# Altium schematic sheet Sheet1.SchDoc
size A2
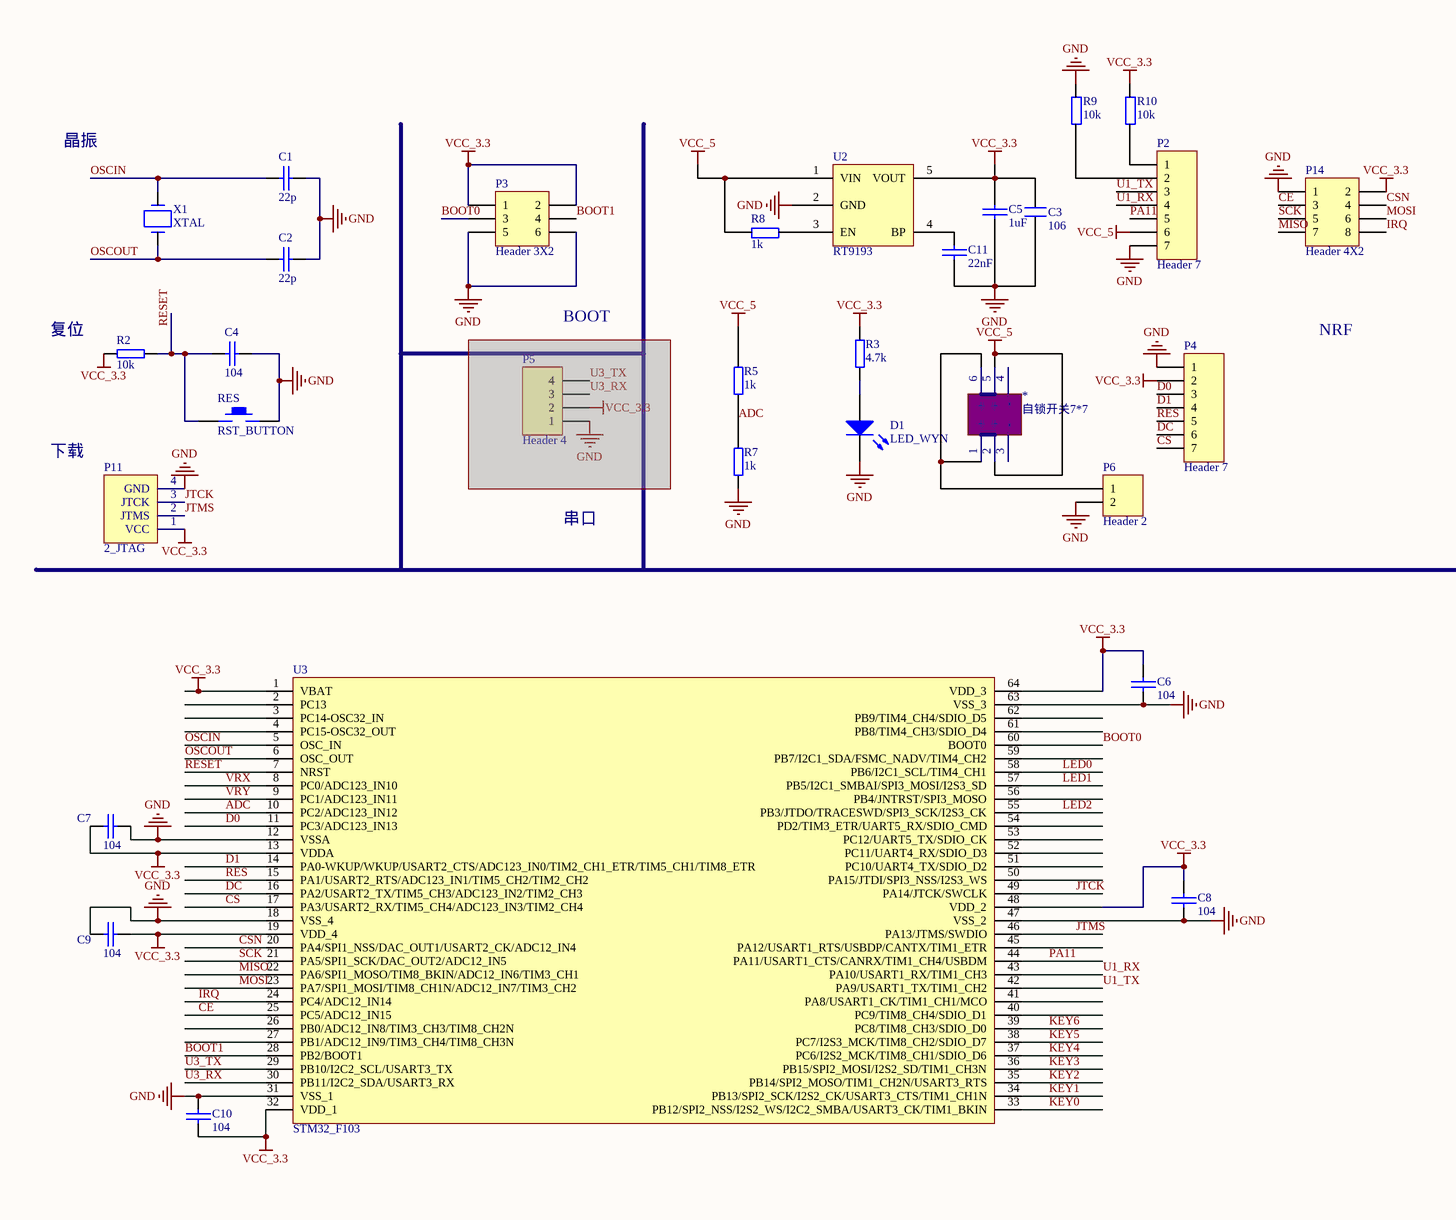
[diagram p0: Sheet1.SchDoc, left]
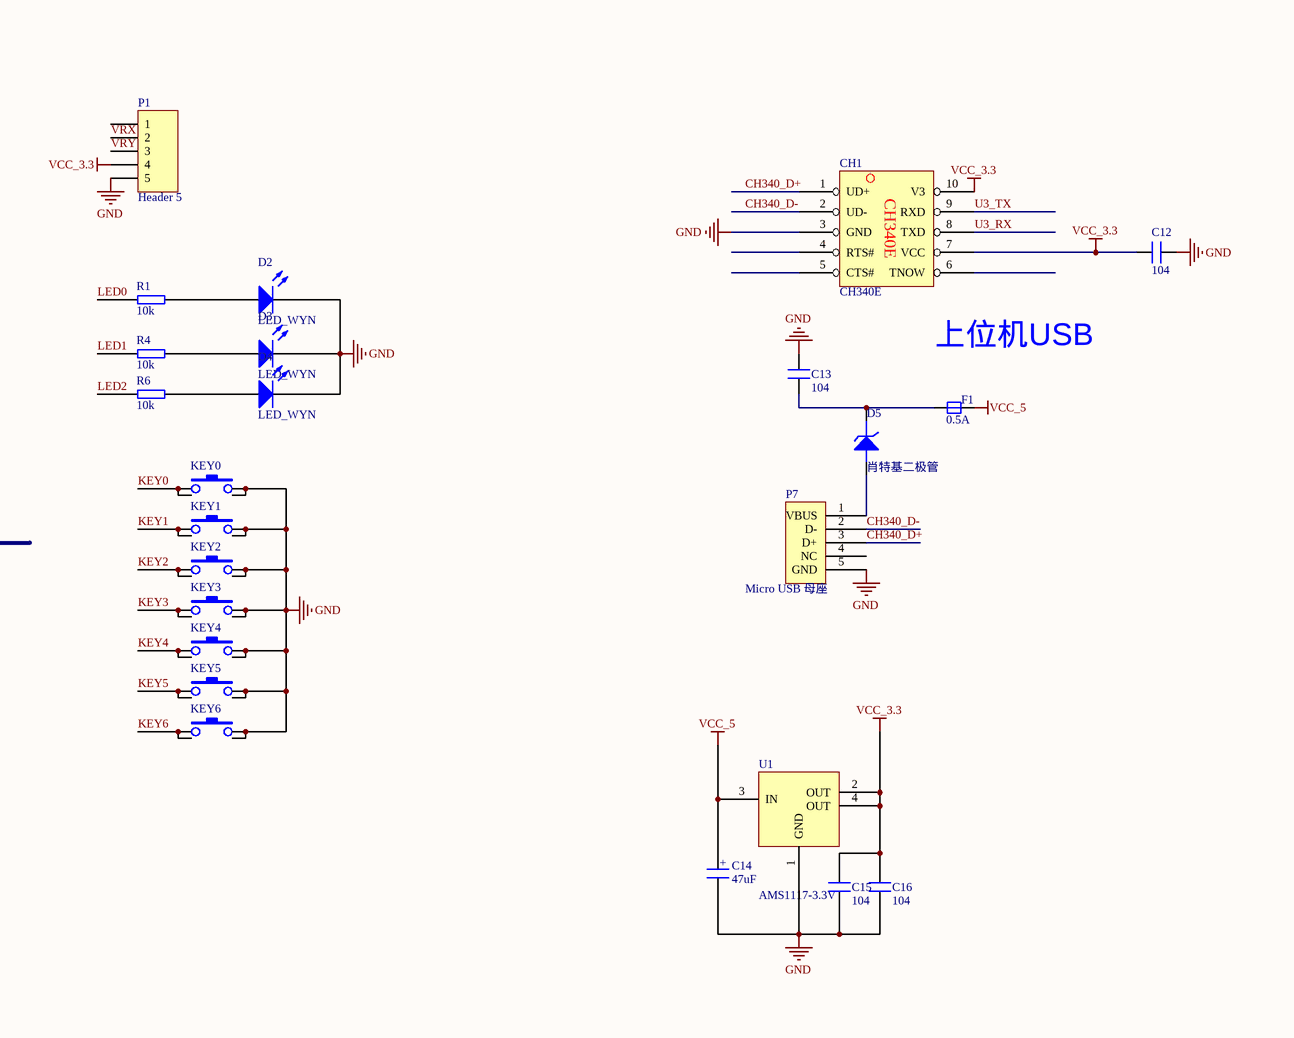
[diagram p1: Sheet1.SchDoc, right]

## Parts
*  自锁开关7*7  [自锁开关7*7]
C1  22p  [C0603]
C2  22p  [C0603]
C3  106  [C0603]
C4  104  [C0603]
C5  1uF  [C0603]
C6  104  [C0603]
C7  104  [C0603]
C8  104  [C0603]
C9  104  [C0603]
C10  104  [C0603]
C11  22nF  [C0603]
C12  104  [C0603]
C13  104  [C0603]
C14  47uF  [A3216]
C15  104  [C0603]
C16  104  [C0603]
CH1  CH340E  [CH340E]
D1  LED_WYN  [极性0603]
D2  LED_WYN  [极性0603]
D3  LED_WYN  [极性0603]
D4  LED_WYN  [极性0603]
D5  肖特基二极管  [1206]
F1  0.5A  [6-0805_M]
KEY0  6*6*9mm微动开关  [6*6*9mm贴片微动开关]  (value not drawn)
KEY1  6*6*9mm微动开关  [6*6*9mm贴片微动开关]  (value not drawn)
KEY2  6*6*9mm微动开关  [6*6*9mm贴片微动开关]  (value not drawn)
KEY3  6*6*9mm微动开关  [6*6*9mm贴片微动开关]  (value not drawn)
KEY4  6*6*9mm微动开关  [6*6*9mm贴片微动开关]  (value not drawn)
KEY5  6*6*9mm微动开关  [6*6*9mm贴片微动开关]  (value not drawn)
KEY6  6*6*9mm微动开关  [6*6*9mm贴片微动开关]  (value not drawn)
P1  Header 5  [HDR1X5]
P2  Header 7  [HDR1X7]
P3  Header 3X2  [HDR2X3]
P4  Header 7  [HDR1X7]
P5  Header 4  [HDR1X4]  (masked out: inside a compile mask, not in the netlist)
P6  Header 2  [XT30_母]
P7  Micro USB 母座  [Micro USB 直插母座]
P11  2_JTAG  [HDR1X4]
P14  Header 4X2  [HDR2X4]
R1  10k  [C0603]
R2  10k  [C0603]
R3  4.7k  [C0603]
R4  10k  [C0603]
R5  1k  [C0603]
R6  10k  [C0603]
R7  1k  [C0603]
R8  1k  [C0603]
R9  10k  [R0603]
R10  10k  [R0603]
RES  RST_BUTTON  [CLCK]
U1  AMS1117-3.3V  [AMS1117-SOT223]
U2  RT9193  [SOT-23-5]
U3  STM32_F103  [STM32TSQFP50P1200X1200X160-64N]
X1  XTAL  [XTAL_D]

## Nets
GND: C1.2 C2.2 C3.1 C4.2 C5.2 C6.2 C7.1 C8.2 C9.2 C10.2 C11.2 C12.2 C13.2 C14.1 C15.1 C16.1 CH1.3(GND) D1.2(K) D2.2(K) D3.2(K) D4.2(K) KEY0.3 KEY0.4 KEY1.3 KEY1.4 KEY2.3 KEY2.4 KEY3.3 KEY3.4 KEY4.3 KEY4.4 KEY5.3 KEY5.4 KEY6.3 KEY6.4 P1.5 P2.7 P3.5 P3.6 P4.1 P6.2 P7.5(GND) P11.4(GND) P14.1 R7.1 R9.2 RES.2 U1.1(GND) U2.2(GND) U3.12(VSSA) U3.18(VSS_4) U3.31(VSS_1) U3.47(VSS_2) U3.63(VSS_3)
VCC_3.3: C3.2 C5.1 C6.1 C7.2 C8.1 C9.1 C10.1 C12.1 C15.2 C16.2 CH1.7(VCC) CH1.10(V3) P1.4 P3.1 P3.2 P4.2 P11.1(VCC) P14.2 R2.1 R3.2 R10.2 U1.2(OUT) U1.4(OUT) U2.5(VOUT) U3.1(VBAT) U3.13(VDDA) U3.19(VDD_4) U3.32(VDD_1) U3.48(VDD_2) U3.64(VDD_3)
VCC_5: *.2(+) *.5(+) C14.2 F1.2 P2.6 R5.2 R8.1 U1.3(IN) U2.1(VIN)
ADC: R5.1 R7.2 U3.10(PC2/ADC123_IN12)
BOOT0: P3.3 U3.60(BOOT0)
BOOT1: P3.4 U3.28(PB2/BOOT1)
CE: P14.3 U3.25(PC5/ADC12_IN15)
CH340_D+: CH1.1(UD+) P7.3(D+)
CH340_D-: CH1.2(UD-) P7.2(D-)
CS: P4.7 U3.17(PA3/USART2_RX/TIM5_CH4/ADC123_IN3/TIM2_CH4)
CSN: P14.4 U3.20(PA4/SPI1_NSS/DAC_OUT1/USART2_CK/ADC12_IN4)
D0: P4.3 U3.11(PC3/ADC123_IN13)
D1: P4.4 U3.14(PA0-WKUP/WKUP/USART2_CTS/ADC123_IN0/TIM2_CH1_ETR/TIM5_CH1/TIM8_ETR)
DC: P4.6 U3.16(PA2/USART2_TX/TIM5_CH3/ADC123_IN2/TIM2_CH3)
IRQ: P14.8 U3.24(PC4/ADC12_IN14)
JTCK: P11.3(JTCK) U3.49(PA14/JTCK/SWCLK)
JTMS: P11.2(JTMS) U3.46(PA13/JTMS/SWDIO)
KEY0: KEY0.1 KEY0.2 U3.33(PB12/SPI2_NSS/I2S2_WS/I2C2_SMBA/USART3_CK/TIM1_BKIN)
KEY1: KEY1.1 KEY1.2 U3.34(PB13/SPI2_SCK/I2S2_CK/USART3_CTS/TIM1_CH1N)
KEY2: KEY2.1 KEY2.2 U3.35(PB14/SPI2_MOSO/TIM1_CH2N/USART3_RTS)
KEY3: KEY3.1 KEY3.2 U3.36(PB15/SPI2_MOSI/I2S2_SD/TIM1_CH3N)
KEY4: KEY4.1 KEY4.2 U3.37(PC6/I2S2_MCK/TIM8_CH1/SDIO_D6)
KEY5: KEY5.1 KEY5.2 U3.38(PC7/I2S3_MCK/TIM8_CH2/SDIO_D7)
KEY6: KEY6.1 KEY6.2 U3.39(PC8/TIM8_CH3/SDIO_D0)
LED0: R1.1 U3.58(PB6/I2C1_SCL/TIM4_CH1)
LED1: R4.1 U3.57(PB5/I2C1_SMBAI/SPI3_MOSI/I2S3_SD)
LED2: R6.1 U3.55(PB3/JTDO/TRACESWD/SPI3_SCK/I2S3_CK)
MISO: P14.7 U3.22(PA6/SPI1_MOSO/TIM8_BKIN/ADC12_IN6/TIM3_CH1)
MOSI: P14.6 U3.23(PA7/SPI1_MOSI/TIM8_CH1N/ADC12_IN7/TIM3_CH2)
OSCIN: C1.1 U3.5(OSC_IN) X1.2
OSCOUT: C2.1 U3.6(OSC_OUT) X1.1
PA11: P2.5 U3.44(PA11/USART1_CTS/CANRX/TIM1_CH4/USBDM)
RES: P4.5 U3.15(PA1/USART2_RTS/ADC123_IN1/TIM5_CH2/TIM2_CH2)
RESET: C4.1 R2.2 RES.1 U3.7(NRST)
SCK: P14.5 U3.21(PA5/SPI1_SCK/DAC_OUT2/ADC12_IN5)
U1_RX: P2.4 U3.43(PA10/USART1_RX/TIM1_CH3)
U1_TX: P2.3 U3.42(PA9/USART1_TX/TIM1_CH2)
U3_RX: CH1.8(TXD) U3.30(PB11/I2C2_SDA/USART3_RX)
U3_TX: CH1.9(RXD) U3.29(PB10/I2C2_SCL/USART3_TX)
VRX: P1.2 U3.8(PC0/ADC123_IN10)
VRY: P1.3 U3.9(PC1/ADC123_IN11)
Net*_1: *.1(+) *.6(+) P6.1
NetC11_1: C11.1 U2.4(BP)
NetC13_1: C13.1 D5.2(K) F1.1
NetD1_1: D1.1(A) R3.1
NetD2_1: D2.1(A) R1.2
NetD3_1: D3.1(A) R4.2
NetD4_1: D4.1(A) R6.2
NetD5_1: D5.1(A) P7.1(VBUS)
NetP2_1: P2.1 R10.1
NetP2_2: P2.2 R9.1
NetR8_2: R8.2 U2.3(EN)

Not connected (* = marked no-connect by the designer): * 3(-) 4(-); CH1 4(RTS#) 5(CTS#) 6(TNOW); P1 1; P7 4(NC); U3 2(PC13) 3(PC14-OSC32_IN) 4(PC15-OSC32_OUT) 26(PB0/ADC12_IN8/TIM3_CH3/TIM8_CH2N) 27(PB1/ADC12_IN9/TIM3_CH4/TIM8_CH3N) 40(PC9/TIM8_CH4/SDIO_D1) 41(PA8/USART1_CK/TIM1_CH1/MCO) 45(PA12/USART1_RTS/USBDP/CANTX/TIM1_ETR) 50(PA15/JTDI/SPI3_NSS/I2S3_WS) 51(PC10/UART4_TX/SDIO_D2) 52(PC11/UART4_RX/SDIO_D3) 53(PC12/UART5_TX/SDIO_CK) 54(PD2/TIM3_ETR/UART5_RX/SDIO_CMD) 56(PB4/JNTRST/SPI3_MOSO) 59(PB7/I2C1_SDA/FSMC_NADV/TIM4_CH2) 61(PB8/TIM4_CH3/SDIO_D4) 62(PB9/TIM4_CH4/SDIO_D5)

## Notes on the sheet
- 晶振
- BOOT
- (near R2) 复位
- NRF
- 上位机USB
- 下载
- 串口
- (in symbol Cap_Pol) +

## Library data of the parts
C1 C2 C4-C11 = CAP_WYN
C3 C12 C13 C15 C16 = Cap
C14 = Cap_Pol
D5 = ZENER: Zener Diode
F1 = FUSE
P1 = Header 5: Header, 5-Pin; LatestRevisionDate: 17-Jul-2002; LatestRevisionNote: Re-released for DXP Platform.; Publisher: Altium Limited
P2 P4 = Header 7: Header, 7-Pin; LatestRevisionDate: 17-Jul-2002; LatestRevisionNote: Re-released for DXP Platform.; Publisher: Altium Limited
P3 = Header 3X2: Header, 3-Pin, Dual row; LatestRevisionDate: 17-Jul-2002; LatestRevisionNote: Re-released for DXP Platform.; Publisher: Altium Limited
P5 = Header 4: Header, 4-Pin; LatestRevisionDate: 17-Jul-2002; LatestRevisionNote: Re-released for DXP Platform.; Publisher: Altium Limited
P6 = Header 2: Header, 2-Pin; LatestRevisionDate: 17-Jul-2002; LatestRevisionNote: Re-released for DXP Platform.; Publisher: Altium Limited
P14 = Header 4X2: Header, 4-Pin, Dual row; LatestRevisionDate: 17-Jul-2002; LatestRevisionNote: Re-released for DXP Platform.; Publisher: Altium Limited
R1-R7 = RES_WYN
R8 = Resistor: 电阻
R9 R10 = Resistor